# Altium schematic sheet mainsheet.SchDoc
size A3; SheetNumber: 1; SheetTotal: 4; SPICEModelCacheYMLMKSUE: <root> / <DocumentId>YMLMKSUE</DocumentId> / </root>
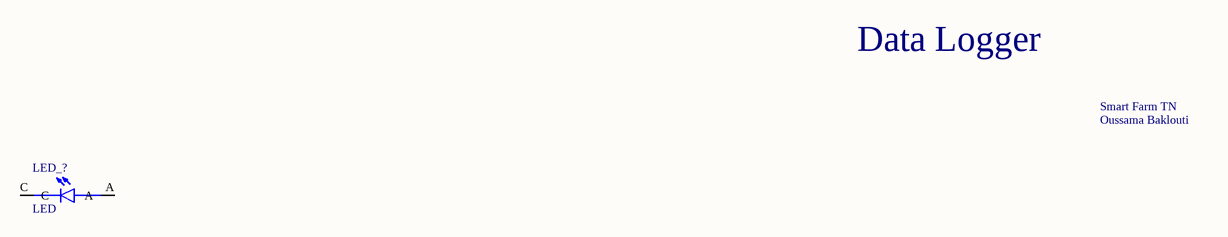
[diagram p0: mainsheet.SchDoc]

## Parts
LED_?  LED

## Nets

Not connected (* = marked no-connect by the designer): LED_? A C

## Notes on the sheet
- Data Logger
- Smart Farm TN
- Oussama Baklouti